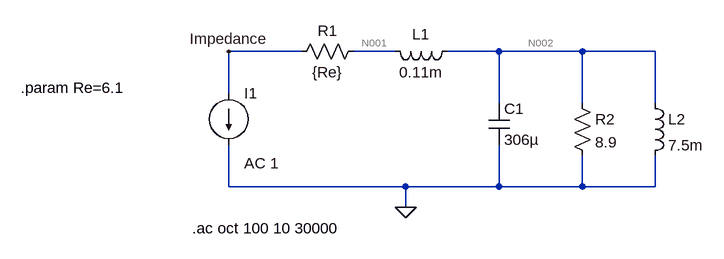
[diagram p0: schematic BasicSim.asc]
BasicSim.asc, the LTspice schematic file:
Version 4
SHEET 1 932 680
WIRE 16 128 -96 128
WIRE 160 128 96 128
WIRE 320 128 240 128
WIRE 448 128 320 128
WIRE 560 128 448 128
WIRE -96 192 -96 128
WIRE 320 208 320 128
WIRE 448 208 448 128
WIRE 560 208 560 128
WIRE -96 336 -96 272
WIRE 176 336 -96 336
WIRE 320 336 320 272
WIRE 320 336 176 336
WIRE 448 336 448 288
WIRE 448 336 320 336
WIRE 560 336 560 288
WIRE 560 336 448 336
WIRE 176 368 176 336
FLAG 176 368 0
FLAG -96 128 Impedance
SYMBOL ind 256 112 R90
WINDOW 0 5 56 VBottom 2
WINDOW 3 32 56 VTop 2
SYMATTR InstName L1
SYMATTR Value 0.11m
SYMBOL res 112 112 R90
WINDOW 0 0 56 VBottom 2
WINDOW 3 32 56 VTop 2
SYMATTR InstName R1
SYMATTR Value {Re}
SYMBOL current -96 192 R0
WINDOW 123 24 108 Left 2
WINDOW 39 0 0 Left 2
SYMATTR Value2 AC 1
SYMATTR InstName I1
SYMATTR Value ""
SYMBOL cap 304 208 R0
SYMATTR InstName C1
SYMATTR Value 306µ
SYMBOL res 432 192 R0
SYMATTR InstName R2
SYMATTR Value 8.9
SYMBOL ind 544 192 R0
SYMATTR InstName L2
SYMATTR Value 7.5m
TEXT -152 400 Left 2 !.ac oct 100 10 30000
TEXT -416 184 Left 2 !.param Re=6.1

The netlist it stands for:
* BasicSim.asc
L1 N002 N001 0.11m
R1 N001 Impedance {Re}
I1 Impedance 0 AC 1
C1 N002 0 306µ
R2 N002 0 8.9
L2 N002 0 7.5m
.ac oct 100 10 30000
.param Re=6.1
.backanno
.end

* Results of the author's LTspice run, read from the files saved beside the schematic
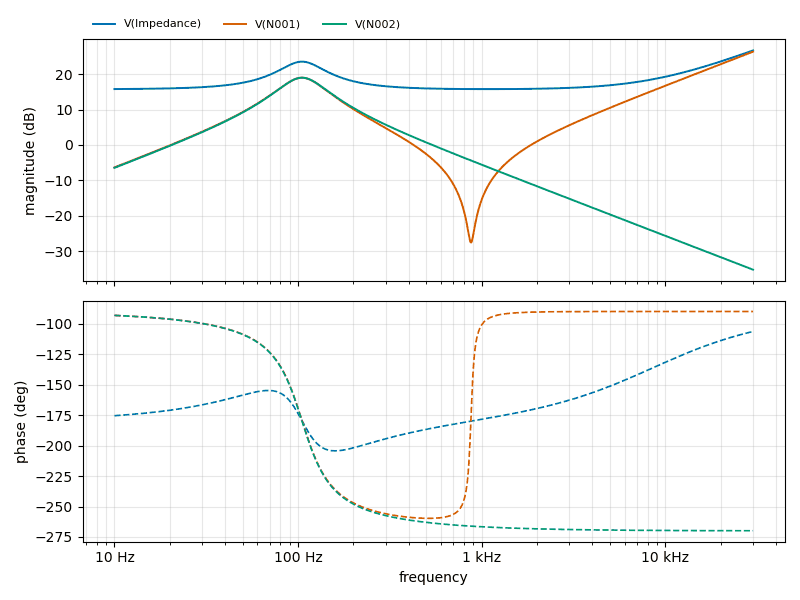
[diagram p1: AC Analysis of BasicSim.asc, plotted from the saved traces]
* AC Analysis, 1 run:
*   V(Impedance): 15.77 dB at 10 Hz, 26.69 dB at 30 kHz, peak 26.69 dB at 30 kHz, 3 dB below the peak at 20.29 kHz
*   V(N001): -6.34 dB at 10 Hz, 26.33 dB at 30 kHz, peak 26.33 dB at 30 kHz, 3 dB below the peak at 21.23 kHz
*   V(N002): -6.47 dB at 10 Hz, -35.22 dB at 30 kHz, peak 18.98 dB at 104.8 Hz, 3 dB below the peak at 79.82 Hz and 138.3 Hz